# EAGLE schematic big_seven_control_v0.2 (EAGLE 7.5.0)
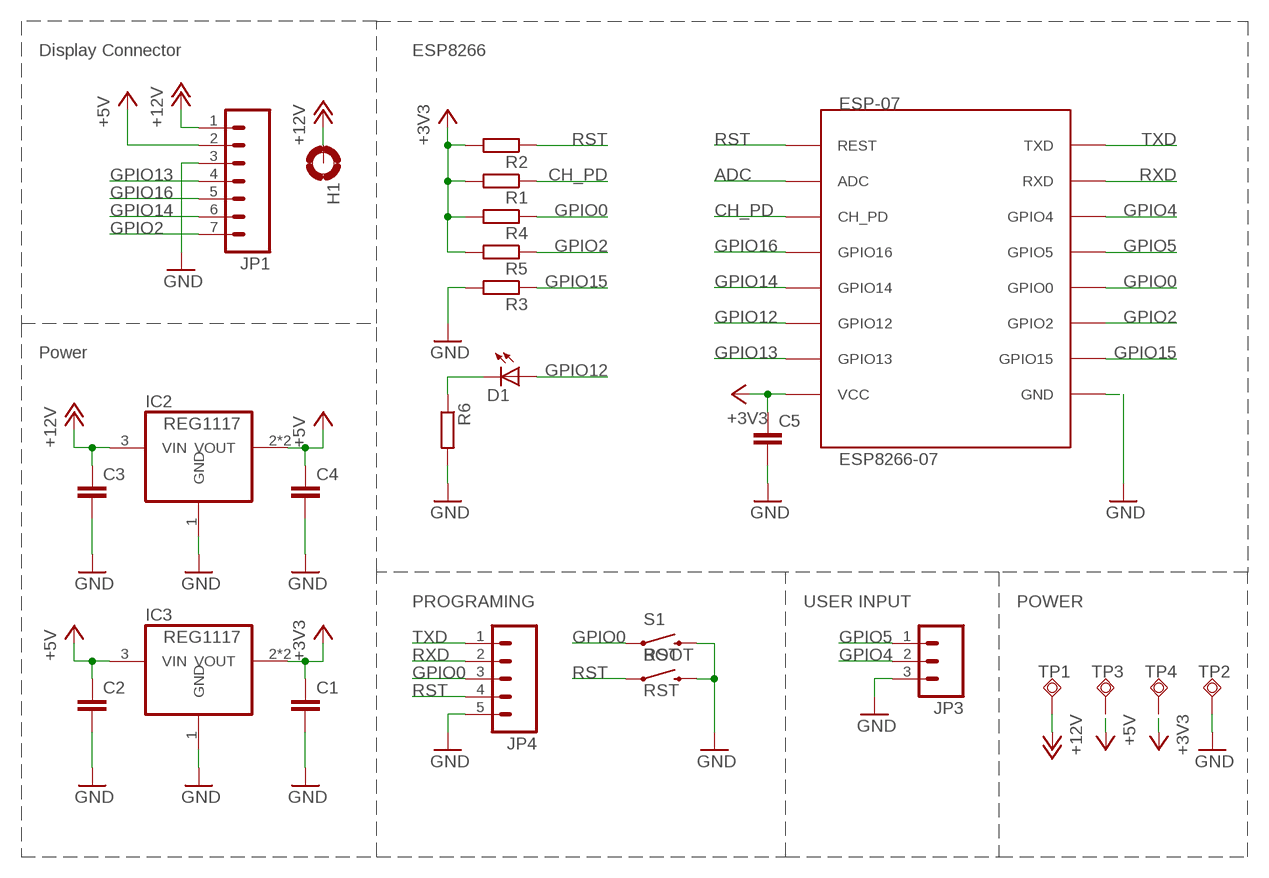
[diagram p0: schematic, sheet 1]

## Parts
C1  C-EUC1206K  [C1206K]
C2  C-EUC1206K  [C1206K]
C3  C-EUC1206K  [C1206K]
C4  C-EUC1206K  [C1206K]
C5  C-EUC0805  [C0805]
D1  LEDCHIP-LED0805  [CHIP-LED0805]
ESP-07  ESP8266-07  [ESP-07]
H1  MOUNT-PAD-ROUND3.2  [3,2-PAD]
IC2  REG1117  [SOT223]
IC3  REG1117  [SOT223]
JP1  M07LOCK  [1X07_LOCK]
JP3  M03LOCK  [1X03_LOCK]
JP4  M05LOCK  [1X05_LOCK]
R1  R-EU_R0805  [R0805]
R2  R-EU_R0805  [R0805]
R3  R-EU_R0805  [R0805]
R4  R-EU_R0805  [R0805]
R5  R-EU_R0805  [R0805]
R6  R-EU_R0805  [R0805]
RST  RST  SWITCH-MOMENTARY-2SMD  [TACTILE-SWITCH-SMD]
S1  BOOT  SWITCH-MOMENTARY-2SMD  [TACTILE-SWITCH-SMD]
TP1  12V  TPSQTP20R  [TP20R]
TP2  delk  TPSQTP20R  [TP20R]
TP3  5V  TPSQTP20R  [TP20R]
TP4  3V3  TPSQTP20R  [TP20R]

## Nets
+3V3: C1.1 C5.1 ESP-07.VCC IC3.2(VOUT) IC3.4(VOUT) R1.2 R2.2 R4.2 R5.2 TP4.TP
+5V: C2.1 C4.1 IC2.2(VOUT) IC2.4(VOUT) IC3.3(VIN) JP1.2 TP3.TP
+12V: C3.1 H1.B3,2(MOUNT) IC2.3(VIN) JP1.1 TP1.TP
ADC: ESP-07.ADC
CH_PD: ESP-07.CH_PD R1.1
GND: C1.2 C2.2 C3.2 C4.2 C5.2 ESP-07.GND IC2.1(GND) IC3.1(GND) JP1.3 JP3.3 JP4.5 R3.2 R6.2 RST.3 S1.3 TP2.TP
GPIO0: ESP-07.GPIO0 JP4.3 R4.1 S1.1
GPIO2: ESP-07.GPIO2 JP1.7 R5.1
GPIO4: ESP-07.GPIO4 JP3.2
GPIO5: ESP-07.GPIO5 JP3.1
GPIO12: D1.A ESP-07.GPIO12
GPIO13: ESP-07.GPIO13 JP1.4
GPIO14: ESP-07.GPIO14 JP1.5
GPIO15: ESP-07.GPIO15 R3.1
GPIO16: ESP-07.GPIO16 JP1.6
N$1: D1.C R6.1
RST: ESP-07.REST JP4.4 R2.1 RST.1
RXD: ESP-07.RXD JP4.2
TXD: ESP-07.TXD JP4.1

## Notes on the sheet
- Display Connector | ESP8266
- Power
- PROGRAMING | USER INPUT | POWER

## Library data of the parts
C1-C5 = resistor:C-EU: CAPACITOR, European symbol
D1 = led:LED: LED OSRAM: - CHIPLED LG R971, LG N971, LY N971, LG Q971, LY Q971, LO R971, LY R971 LH N974, LH R974 LS Q976, LO Q976, LY Q976 LO Q996 - Hyper CHIPLED LW Q18S LB Q993, LB Q99A, LB R99A - SideLED LS A670, LO A670, LY A670, LG A670, LP A670 LB A673, LV A673, LT A673, LW A673 LH A674 LY A675 LS A676, LA A676, LO A676, LY A676, LW A676 LS A679, LY A679, LG A679 - Hyper Micro SIDELED® LS Y876, LA Y876, LO Y876, LY Y876 LT Y87S - SmartLED LW L88C, LW L88S LB L89C, LB L89S, LG L890 LS L89K, LO L89K, LY L89K LS L896, LA L896, LO L896, LY L896 - TOPLED LS T670, LO T670, LY T670, LG T670, LP T670 LSG T670, LSP T670, LSY T670, LOP T670, LYG T670 LG T671, LOG T671, LSG T671 LB T673, LV T673, LT T673, LW T673 LH T674 LS T676, LA T676, LO T676, LY T676, LB T676, LH T676, LSB T676, LW T676 LB T67C, LV T67C, LT T67C, LS T67K, LO T67K, LY T67K, LW E67C LS E67B, LA E67B, LO E67B, LY E67B, LB E67C, LV E67C, LT E67C LW T67C LS T679, LY T679, LG T679 LS T770, LO T770, LY T770, LG T770, LP T770 LB T773, LV T773, LT T773, LW T773 LH T774 LS E675, LA E675, LY E675, LS T675 LS T776, LA T776, LO T776, LY T776, LB T776 LHGB T686 LT T68C, LB T68C - Hyper Mini TOPLED® LB M676 - Mini TOPLED Santana® LG M470 LS M47K, LO M47K, LY M47K Source: http://www.osram.convergy.de LUXEON: - LUMILED® LXK2-PW12-R00, LXK2-PW12-S00, LXK2-PW14-U00, LXK2-PW14-V00 LXK2-PM12-R00, LXK2-PM12-S00, LXK2-PM14-U00 LXK2-PE12-Q00, LXK2-PE12-R00, LXK2-PE12-S00, LXK2-PE14-T00, LXK2-PE14-U00 LXK2-PB12-K00, LXK2-PB12-L00, LXK2-PB12-M00, LXK2-PB14-N00, LXK2-PB14-P00, LXK2-PB14-Q00 LXK2-PR12-L00, LXK2-PR12-M00, LXK2-PR14-Q00, LXK2-PR14-R00 LXK2-PD12-Q00, LXK2-PD12-R00, LXK2-PD12-S00 LXK2-PH12-R00, LXK2-PH12-S00 LXK2-PL12-P00, LXK2-PL12-Q00, LXK2-PL12-R00 Source: www.luxeon.com KINGBRIGHT: KA-3528ASYC Source: www.kingbright.com
ESP-07 = lio:ESP8266
H1 = holes:MOUNT-PAD-ROUND: MOUNTING PAD, round
IC2 IC3 = burr-brown:REG1117: 800mA and 1A Low Dropout (LDO) Positive Regulator 1.8V, 2.5V, 2.85V, 3.3V, 5V, and Adj; MPN: REG1117; OC_FARNELL: 1097566; OC_NEWARK: 14P6981
JP1 = SparkFun-Connectors:M07: Header 7 Standard 7-pin 0.1" header. Use with straight break away headers (SKU : PRT-00116), right angle break away headers (PRT-00553), swiss pins (PRT-00743), machine pins (PRT-00117), and female headers (PRT-00115). NOTES ON THE VARIANTS LOCK and LOCK_LONGPADS... This footprint was designed to help hold the alignment of a through-hole component (i.e. 7-pin header) while soldering it into place. You may notice that each hole has been shifted either up or down by 0.005 of an inch from it's more standard position (which is usually a perfectly straight line). This slight alteration caused the pins (the squares in the middle) to touch the edges of the holes. Because they are alternating, it causes a "brace" to hold the header in place. 0.005 has proven to be the perfect amount of "off-center" position when using our standard breakaway headers. Although looks a little odd when you look at the bare footprint, once you have a header in there, the alteration is very hard to notice. Also, if you push a header all the way into place, it is covered up entirely on the bottom side. This idea of altering the position of holes to aid alignment will be further integrated into the Sparkfun Library for other footprints. It can help hold any component with 3 or more connection pins.
JP3 = SparkFun-Connectors:M03: Header 3 Standard 3-pin 0.1" header. Use with straight break away headers (SKU : PRT-00116), right angle break away headers (PRT-00553), swiss pins (PRT-00743), machine pins (PRT-00117), and female headers (PRT-00115). Molex polarized connector foot print use with SKU : PRT-08232 with associated crimp pins and housings.
JP4 = SparkFun-Connectors:M05: Header 5 Standard 5-pin 0.1" header. Use with straight break away headers (SKU : PRT-00116), right angle break away headers (PRT-00553), swiss pins (PRT-00743), machine pins (PRT-00117), and female headers (PRT-00115). Molex polarized connector foot print use with SKU : PRT-08230 with associated crimp pins and housings.
R1-R6 = rcl:R-EU_: RESISTOR, European symbol
RST S1 = SparkFun-Electromechanical:SWITCH-MOMENTARY-2: Various NO switches- pushbuttons, reed, etc; PROD_ID: SWCH-08247
TP1-TP4 = testpad:TPSQ: Test pad